# Altium schematic sheet output enable switches.SchDoc
size A4
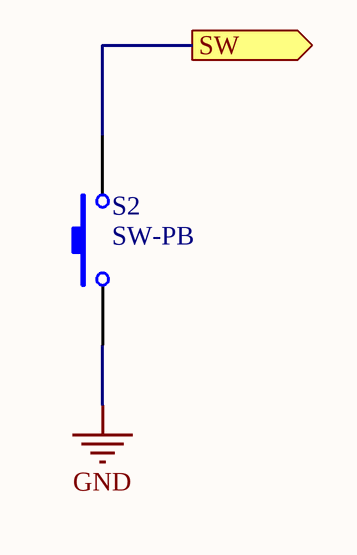
[diagram p0: output enable switches.SchDoc]

## Parts
S2  SW-PB  [DTSM-32S-B]

## Ports
SW (out)

## Nets
GND: S2.1
SW: S2.2 ; port SW

## Library data of the parts
S2 = SW-PB: Switch; Published: 24-Mar-1999; LatestRevisionDate: 17-Jul-2002; LatestRevisionNote: Re-released for DXP Platform.; PackageReference: SPST-2; Publisher: Altium Limited; farnell: 9471898